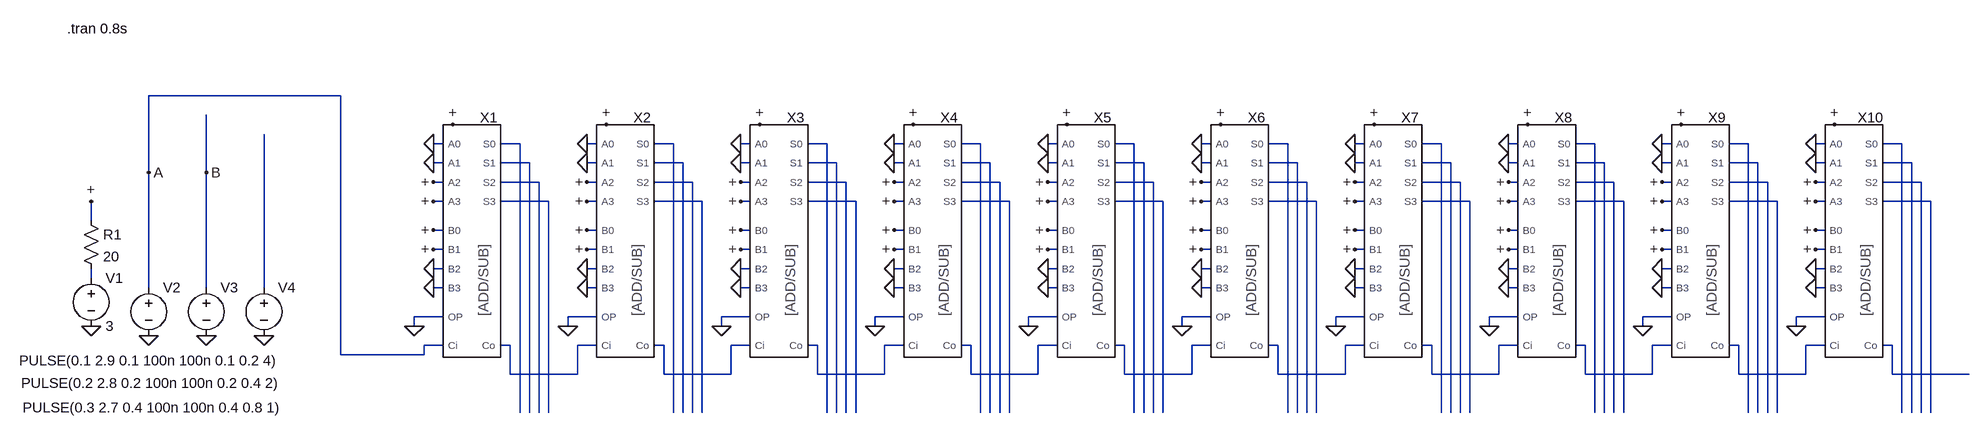
[diagram p0: schematic main.asc]
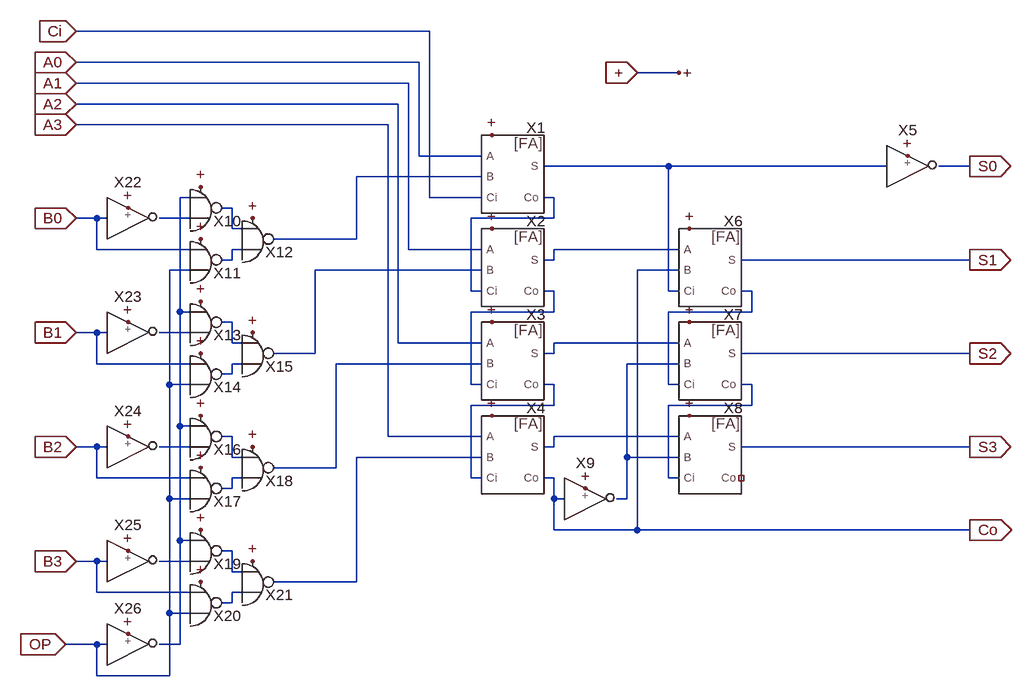
[diagram p1: sub-circuit addsub.asc]
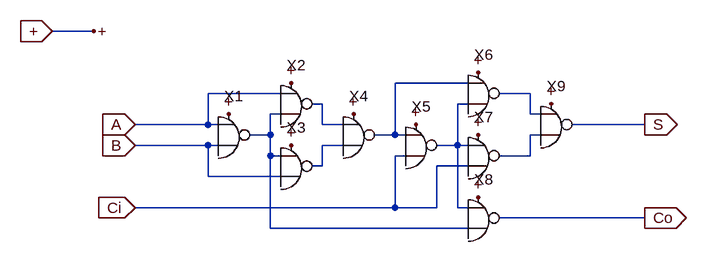
[diagram p2: sub-circuit fa.asc]
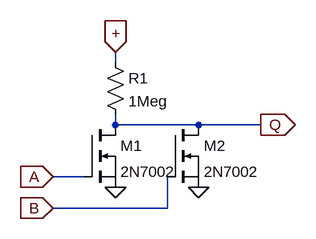
[diagram p3: sub-circuit nor2.asc]
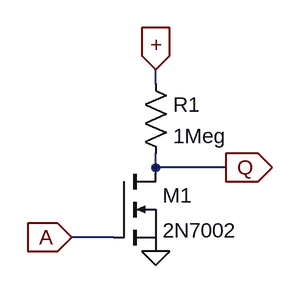
[diagram p4: sub-circuit inv.asc]
main.asc, the LTspice schematic file:
Version 4
SHEET 1 2644 1588
WIRE -208 1056 -528 1056
WIRE 96 1136 80 1136
WIRE 224 1136 192 1136
WIRE 352 1136 336 1136
WIRE 480 1136 448 1136
WIRE 608 1136 592 1136
WIRE 736 1136 704 1136
WIRE 864 1136 848 1136
WIRE 992 1136 960 1136
WIRE 1120 1136 1104 1136
WIRE 1248 1136 1216 1136
WIRE 1376 1136 1360 1136
WIRE 1504 1136 1472 1136
WIRE 1632 1136 1616 1136
WIRE 1760 1136 1728 1136
WIRE 1888 1136 1872 1136
WIRE 2016 1136 1984 1136
WIRE 2144 1136 2128 1136
WIRE 2272 1136 2240 1136
WIRE 2400 1136 2384 1136
WIRE 2528 1136 2496 1136
WIRE 96 1168 80 1168
WIRE 240 1168 192 1168
WIRE 352 1168 336 1168
WIRE 496 1168 448 1168
WIRE 608 1168 592 1168
WIRE 752 1168 704 1168
WIRE 864 1168 848 1168
WIRE 1008 1168 960 1168
WIRE 1120 1168 1104 1168
WIRE 1264 1168 1216 1168
WIRE 1376 1168 1360 1168
WIRE 1520 1168 1472 1168
WIRE 1632 1168 1616 1168
WIRE 1776 1168 1728 1168
WIRE 1888 1168 1872 1168
WIRE 2032 1168 1984 1168
WIRE 2144 1168 2128 1168
WIRE 2288 1168 2240 1168
WIRE 2400 1168 2384 1168
WIRE 2544 1168 2496 1168
WIRE -528 1184 -528 1056
WIRE -432 1184 -432 1088
WIRE 96 1200 80 1200
WIRE 256 1200 192 1200
WIRE 352 1200 336 1200
WIRE 512 1200 448 1200
WIRE 608 1200 592 1200
WIRE 768 1200 704 1200
WIRE 864 1200 848 1200
WIRE 1024 1200 960 1200
WIRE 1120 1200 1104 1200
WIRE 1280 1200 1216 1200
WIRE 1376 1200 1360 1200
WIRE 1536 1200 1472 1200
WIRE 1632 1200 1616 1200
WIRE 1792 1200 1728 1200
WIRE 1888 1200 1872 1200
WIRE 2048 1200 1984 1200
WIRE 2144 1200 2128 1200
WIRE 2304 1200 2240 1200
WIRE 2400 1200 2384 1200
WIRE 2560 1200 2496 1200
WIRE 96 1232 80 1232
WIRE 272 1232 192 1232
WIRE 352 1232 336 1232
WIRE 528 1232 448 1232
WIRE 608 1232 592 1232
WIRE 784 1232 704 1232
WIRE 864 1232 848 1232
WIRE 1040 1232 960 1232
WIRE 1120 1232 1104 1232
WIRE 1296 1232 1216 1232
WIRE 1376 1232 1360 1232
WIRE 1552 1232 1472 1232
WIRE 1632 1232 1616 1232
WIRE 1808 1232 1728 1232
WIRE 1888 1232 1872 1232
WIRE 2064 1232 1984 1232
WIRE 2144 1232 2128 1232
WIRE 2320 1232 2240 1232
WIRE 2400 1232 2384 1232
WIRE 2576 1232 2496 1232
WIRE -624 1264 -624 1232
WIRE 96 1280 80 1280
WIRE 352 1280 336 1280
WIRE 608 1280 592 1280
WIRE 864 1280 848 1280
WIRE 1120 1280 1104 1280
WIRE 1376 1280 1360 1280
WIRE 1632 1280 1616 1280
WIRE 1888 1280 1872 1280
WIRE 2144 1280 2128 1280
WIRE 2400 1280 2384 1280
WIRE 96 1312 80 1312
WIRE 352 1312 336 1312
WIRE 608 1312 592 1312
WIRE 864 1312 848 1312
WIRE 1120 1312 1104 1312
WIRE 1376 1312 1360 1312
WIRE 1632 1312 1616 1312
WIRE 1888 1312 1872 1312
WIRE 2144 1312 2128 1312
WIRE 2400 1312 2384 1312
WIRE 96 1344 80 1344
WIRE 352 1344 336 1344
WIRE 608 1344 592 1344
WIRE 864 1344 848 1344
WIRE 1120 1344 1104 1344
WIRE 1376 1344 1360 1344
WIRE 1632 1344 1616 1344
WIRE 1888 1344 1872 1344
WIRE 2144 1344 2128 1344
WIRE 2400 1344 2384 1344
WIRE -624 1360 -624 1344
WIRE -528 1376 -528 1184
WIRE -432 1376 -432 1184
WIRE -336 1376 -336 1120
WIRE 96 1376 80 1376
WIRE 352 1376 336 1376
WIRE 608 1376 592 1376
WIRE 864 1376 848 1376
WIRE 1120 1376 1104 1376
WIRE 1376 1376 1360 1376
WIRE 1632 1376 1616 1376
WIRE 1888 1376 1872 1376
WIRE 2144 1376 2128 1376
WIRE 2400 1376 2384 1376
WIRE 96 1424 48 1424
WIRE 352 1424 304 1424
WIRE 608 1424 560 1424
WIRE 864 1424 816 1424
WIRE 1120 1424 1072 1424
WIRE 1376 1424 1328 1424
WIRE 1632 1424 1584 1424
WIRE 1888 1424 1840 1424
WIRE 2144 1424 2096 1424
WIRE 2400 1424 2352 1424
WIRE 48 1440 48 1424
WIRE 304 1440 304 1424
WIRE 560 1440 560 1424
WIRE 816 1440 816 1424
WIRE 1072 1440 1072 1424
WIRE 1328 1440 1328 1424
WIRE 1584 1440 1584 1424
WIRE 1840 1440 1840 1424
WIRE 2096 1440 2096 1424
WIRE 2352 1440 2352 1424
WIRE 96 1472 64 1472
WIRE 208 1472 192 1472
WIRE 352 1472 320 1472
WIRE 464 1472 448 1472
WIRE 608 1472 576 1472
WIRE 720 1472 704 1472
WIRE 864 1472 832 1472
WIRE 976 1472 960 1472
WIRE 1120 1472 1088 1472
WIRE 1232 1472 1216 1472
WIRE 1376 1472 1344 1472
WIRE 1488 1472 1472 1472
WIRE 1632 1472 1600 1472
WIRE 1744 1472 1728 1472
WIRE 1888 1472 1856 1472
WIRE 2000 1472 1984 1472
WIRE 2144 1472 2112 1472
WIRE 2256 1472 2240 1472
WIRE 2400 1472 2368 1472
WIRE 2512 1472 2496 1472
WIRE -208 1488 -208 1056
WIRE 64 1488 64 1472
WIRE 64 1488 -208 1488
WIRE 208 1520 208 1472
WIRE 320 1520 320 1472
WIRE 320 1520 208 1520
WIRE 464 1520 464 1472
WIRE 576 1520 576 1472
WIRE 576 1520 464 1520
WIRE 720 1520 720 1472
WIRE 832 1520 832 1472
WIRE 832 1520 720 1520
WIRE 976 1520 976 1472
WIRE 1088 1520 1088 1472
WIRE 1088 1520 976 1520
WIRE 1232 1520 1232 1472
WIRE 1344 1520 1344 1472
WIRE 1344 1520 1232 1520
WIRE 1488 1520 1488 1472
WIRE 1600 1520 1600 1472
WIRE 1600 1520 1488 1520
WIRE 1744 1520 1744 1472
WIRE 1856 1520 1856 1472
WIRE 1856 1520 1744 1520
WIRE 2000 1520 2000 1472
WIRE 2112 1520 2112 1472
WIRE 2112 1520 2000 1520
WIRE 2256 1520 2256 1472
WIRE 2368 1520 2368 1472
WIRE 2368 1520 2256 1520
WIRE 2512 1520 2512 1472
WIRE 2640 1520 2512 1520
WIRE 224 1584 224 1136
WIRE 240 1584 240 1168
WIRE 256 1584 256 1200
WIRE 272 1584 272 1232
WIRE 480 1584 480 1136
WIRE 496 1584 496 1168
WIRE 512 1584 512 1200
WIRE 528 1584 528 1232
WIRE 736 1584 736 1136
WIRE 752 1584 752 1168
WIRE 768 1584 768 1200
WIRE 784 1584 784 1232
WIRE 992 1584 992 1136
WIRE 1008 1584 1008 1168
WIRE 1024 1584 1024 1200
WIRE 1040 1584 1040 1232
WIRE 1248 1584 1248 1136
WIRE 1264 1584 1264 1168
WIRE 1280 1584 1280 1200
WIRE 1296 1584 1296 1232
WIRE 1504 1584 1504 1136
WIRE 1520 1584 1520 1168
WIRE 1536 1584 1536 1200
WIRE 1552 1584 1552 1232
WIRE 1760 1584 1760 1136
WIRE 1776 1584 1776 1168
WIRE 1792 1584 1792 1200
WIRE 1808 1584 1808 1232
WIRE 2016 1584 2016 1136
WIRE 2032 1584 2032 1168
WIRE 2048 1584 2048 1200
WIRE 2064 1584 2064 1232
WIRE 2272 1584 2272 1136
WIRE 2288 1584 2288 1168
WIRE 2304 1584 2304 1200
WIRE 2320 1584 2320 1232
WIRE 2528 1584 2528 1136
WIRE 2544 1584 2544 1168
WIRE 2560 1584 2560 1200
WIRE 2576 1584 2576 1232
FLAG -624 1440 0
FLAG -624 1232 +
FLAG -528 1456 0
FLAG -432 1456 0
FLAG -336 1456 0
FLAG -528 1184 A
FLAG -432 1184 B
FLAG 112 1104 +
FLAG 80 1232 +
FLAG 80 1200 +
FLAG 80 1168 0
FLAG 80 1136 0
FLAG 80 1344 0
FLAG 80 1376 0
FLAG 80 1312 +
FLAG 80 1280 +
FLAG 48 1440 0
FLAG 368 1104 +
FLAG 336 1232 +
FLAG 336 1200 +
FLAG 336 1168 0
FLAG 336 1136 0
FLAG 336 1344 0
FLAG 336 1376 0
FLAG 336 1312 +
FLAG 336 1280 +
FLAG 304 1440 0
FLAG 624 1104 +
FLAG 592 1232 +
FLAG 592 1200 +
FLAG 592 1168 0
FLAG 592 1136 0
FLAG 592 1344 0
FLAG 592 1376 0
FLAG 592 1312 +
FLAG 592 1280 +
FLAG 560 1440 0
FLAG 880 1104 +
FLAG 848 1232 +
FLAG 848 1200 +
FLAG 848 1168 0
FLAG 848 1136 0
FLAG 848 1344 0
FLAG 848 1376 0
FLAG 848 1312 +
FLAG 848 1280 +
FLAG 816 1440 0
FLAG 1136 1104 +
FLAG 1104 1232 +
FLAG 1104 1200 +
FLAG 1104 1168 0
FLAG 1104 1136 0
FLAG 1104 1344 0
FLAG 1104 1376 0
FLAG 1104 1312 +
FLAG 1104 1280 +
FLAG 1072 1440 0
FLAG 1392 1104 +
FLAG 1360 1232 +
FLAG 1360 1200 +
FLAG 1360 1168 0
FLAG 1360 1136 0
FLAG 1360 1344 0
FLAG 1360 1376 0
FLAG 1360 1312 +
FLAG 1360 1280 +
FLAG 1328 1440 0
FLAG 1648 1104 +
FLAG 1616 1232 +
FLAG 1616 1200 +
FLAG 1616 1168 0
FLAG 1616 1136 0
FLAG 1616 1344 0
FLAG 1616 1376 0
FLAG 1616 1312 +
FLAG 1616 1280 +
FLAG 1584 1440 0
FLAG 1904 1104 +
FLAG 1872 1232 +
FLAG 1872 1200 +
FLAG 1872 1168 0
FLAG 1872 1136 0
FLAG 1872 1344 0
FLAG 1872 1376 0
FLAG 1872 1312 +
FLAG 1872 1280 +
FLAG 1840 1440 0
FLAG 2160 1104 +
FLAG 2128 1232 +
FLAG 2128 1200 +
FLAG 2128 1168 0
FLAG 2128 1136 0
FLAG 2128 1344 0
FLAG 2128 1376 0
FLAG 2128 1312 +
FLAG 2128 1280 +
FLAG 2096 1440 0
FLAG 2416 1104 +
FLAG 2384 1232 +
FLAG 2384 1200 +
FLAG 2384 1168 0
FLAG 2384 1136 0
FLAG 2384 1344 0
FLAG 2384 1376 0
FLAG 2384 1312 +
FLAG 2384 1280 +
FLAG 2352 1440 0
SYMBOL voltage -624 1344 R0
SYMATTR InstName V1
SYMATTR Value 3
SYMATTR SpiceLine Rser=0
SYMBOL res -640 1248 R0
SYMATTR InstName R1
SYMATTR Value 20
SYMBOL voltage -528 1360 R0
WINDOW 3 -216 138 Left 2
SYMATTR InstName V2
SYMATTR Value PULSE(0.1 2.9 0.1 100n 100n 0.1 0.2 4)
SYMBOL voltage -432 1360 R0
WINDOW 3 -309 175 Left 2
SYMATTR InstName V3
SYMATTR Value PULSE(0.2 2.8 0.2 100n 100n 0.2 0.4 2)
SYMBOL voltage -336 1360 R0
WINDOW 3 -402 216 Left 2
SYMATTR InstName V4
SYMATTR Value PULSE(0.3 2.7 0.4 100n 100n 0.4 0.8 1)
SYMBOL AddSub 144 1280 R0
SYMATTR InstName X1
SYMBOL AddSub 400 1280 R0
SYMATTR InstName X2
SYMBOL AddSub 656 1280 R0
SYMATTR InstName X3
SYMBOL AddSub 912 1280 R0
SYMATTR InstName X4
SYMBOL AddSub 1168 1280 R0
SYMATTR InstName X5
SYMBOL AddSub 1424 1280 R0
SYMATTR InstName X6
SYMBOL AddSub 1680 1280 R0
SYMATTR InstName X7
SYMBOL AddSub 1936 1280 R0
SYMATTR InstName X8
SYMBOL AddSub 2192 1280 R0
SYMATTR InstName X9
SYMBOL AddSub 2448 1280 R0
SYMATTR InstName X10
TEXT -664 944 Left 2 !.tran 0.8s

addsub.asc, the sub-circuit schematic file:
Version 4
SHEET 1 1180 680
WIRE 272 -352 -272 -352
WIRE 256 -304 -272 -304
WIRE 656 -288 592 -288
WIRE 240 -272 -272 -272
WIRE 224 -240 -272 -240
WIRE 208 -208 -272 -208
WIRE 256 -160 256 -304
WIRE 352 -160 256 -160
WIRE 640 -144 448 -144
WIRE 976 -144 640 -144
WIRE 1104 -144 1056 -144
WIRE 352 -128 160 -128
WIRE -96 -96 -112 -96
WIRE 272 -96 272 -352
WIRE 352 -96 272 -96
WIRE 464 -96 448 -96
WIRE -32 -80 -48 -80
WIRE -240 -64 -272 -64
WIRE -224 -64 -240 -64
WIRE -96 -64 -144 -64
WIRE 464 -64 464 -96
WIRE 464 -64 336 -64
WIRE -32 -48 -32 -80
WIRE -16 -48 -32 -48
WIRE 160 -32 160 -128
WIRE 160 -32 32 -32
WIRE -240 -16 -240 -64
WIRE -96 -16 -240 -16
WIRE -16 -16 -32 -16
WIRE 240 -16 240 -272
WIRE 352 -16 240 -16
WIRE 656 -16 464 -16
WIRE -32 0 -32 -16
WIRE -32 0 -48 0
WIRE 464 0 464 -16
WIRE 464 0 448 0
WIRE 1104 0 752 0
WIRE -96 16 -128 16
WIRE 352 16 96 16
WIRE 656 16 592 16
WIRE 336 48 336 -64
WIRE 352 48 336 48
WIRE 464 48 448 48
WIRE 640 48 640 -144
WIRE 656 48 640 48
WIRE 768 48 752 48
WIRE -112 80 -112 -96
WIRE -96 80 -112 80
WIRE 464 80 464 48
WIRE 464 80 336 80
WIRE 768 80 768 48
WIRE 768 80 640 80
WIRE -32 96 -48 96
WIRE -240 112 -272 112
WIRE -224 112 -240 112
WIRE -96 112 -144 112
WIRE -32 128 -32 96
WIRE -16 128 -32 128
WIRE 224 128 224 -240
WIRE 352 128 224 128
WIRE 656 128 464 128
WIRE 96 144 96 16
WIRE 96 144 32 144
WIRE 464 144 464 128
WIRE 464 144 448 144
WIRE 1104 144 752 144
WIRE -240 160 -240 112
WIRE -96 160 -240 160
WIRE -16 160 -32 160
WIRE 352 160 128 160
WIRE 656 160 576 160
WIRE -32 176 -32 160
WIRE -32 176 -48 176
WIRE -128 192 -128 16
WIRE -96 192 -128 192
WIRE 336 192 336 80
WIRE 352 192 336 192
WIRE 464 192 448 192
WIRE 640 192 640 80
WIRE 656 192 640 192
WIRE 768 192 752 192
WIRE 464 224 464 192
WIRE 464 224 336 224
WIRE 768 224 768 192
WIRE 768 224 640 224
WIRE -112 256 -112 80
WIRE -96 256 -112 256
WIRE -32 272 -48 272
WIRE 208 272 208 -208
WIRE 352 272 208 272
WIRE 656 272 464 272
WIRE -240 288 -272 288
WIRE -224 288 -240 288
WIRE -96 288 -144 288
WIRE 464 288 464 272
WIRE 464 288 448 288
WIRE 1104 288 752 288
WIRE -32 304 -32 272
WIRE -16 304 -32 304
WIRE 352 304 160 304
WIRE 576 304 576 160
WIRE 656 304 576 304
WIRE 128 320 128 160
WIRE 128 320 32 320
WIRE -240 336 -240 288
WIRE -96 336 -240 336
WIRE -16 336 -32 336
WIRE 336 336 336 224
WIRE 352 336 336 336
WIRE 464 336 448 336
WIRE 640 336 640 224
WIRE 656 336 640 336
WIRE -32 352 -32 336
WIRE -32 352 -48 352
WIRE -128 368 -128 192
WIRE -96 368 -128 368
WIRE 464 368 464 336
WIRE 480 368 464 368
WIRE 576 368 576 304
WIRE 576 368 560 368
WIRE 464 416 464 368
WIRE 592 416 592 16
WIRE 592 416 464 416
WIRE 1104 416 592 416
WIRE -112 432 -112 256
WIRE -96 432 -112 432
WIRE -32 448 -48 448
WIRE -240 464 -272 464
WIRE -224 464 -240 464
WIRE -96 464 -144 464
WIRE -32 480 -32 448
WIRE -16 480 -32 480
WIRE 160 496 160 304
WIRE 160 496 32 496
WIRE -240 512 -240 464
WIRE -96 512 -240 512
WIRE -16 512 -32 512
WIRE -32 528 -32 512
WIRE -32 528 -48 528
WIRE -128 544 -128 368
WIRE -96 544 -128 544
WIRE -240 592 -288 592
WIRE -224 592 -240 592
WIRE -112 592 -112 432
WIRE -112 592 -144 592
WIRE -240 640 -240 592
WIRE -128 640 -128 544
WIRE -128 640 -240 640
FLAG 368 -192 +
FLAG 368 -48 +
FLAG 368 96 +
FLAG 368 240 +
FLAG 672 -48 +
FLAG 672 96 +
FLAG 672 240 +
FLAG 512 352 +
FLAG 1008 -160 +
FLAG -80 -112 +
FLAG -80 -32 +
FLAG 0 -64 +
FLAG -80 64 +
FLAG -80 144 +
FLAG 0 112 +
FLAG -80 240 +
FLAG -80 320 +
FLAG 0 288 +
FLAG -80 416 +
FLAG -80 496 +
FLAG 0 464 +
FLAG -192 -80 +
FLAG -192 96 +
FLAG -192 272 +
FLAG -192 448 +
FLAG -192 576 +
FLAG -288 592 OP
IOPIN -288 592 In
FLAG -272 -352 Ci
IOPIN -272 -352 In
FLAG -272 -304 A0
IOPIN -272 -304 In
FLAG -272 -272 A1
IOPIN -272 -272 In
FLAG -272 -240 A2
IOPIN -272 -240 In
FLAG -272 -208 A3
IOPIN -272 -208 In
FLAG -272 -64 B0
IOPIN -272 -64 In
FLAG -272 112 B1
IOPIN -272 112 In
FLAG -272 288 B2
IOPIN -272 288 In
FLAG -272 464 B3
IOPIN -272 464 In
FLAG 1104 -144 S0
IOPIN 1104 -144 Out
FLAG 1104 0 S1
IOPIN 1104 0 Out
FLAG 1104 144 S2
IOPIN 1104 144 Out
FLAG 1104 288 S3
IOPIN 1104 288 Out
FLAG 1104 416 Co
IOPIN 1104 416 Out
FLAG 592 -288 +
IOPIN 592 -288 In
FLAG 656 -288 +
FLAG 656 -288 +
SYMBOL FA 400 -144 R0
SYMATTR InstName X1
SYMBOL FA 400 0 R0
SYMATTR InstName X2
SYMBOL FA 400 144 R0
SYMATTR InstName X3
SYMBOL FA 400 288 R0
SYMATTR InstName X4
SYMBOL INV 1008 -144 R0
SYMATTR InstName X5
SYMBOL FA 704 0 R0
SYMATTR InstName X6
SYMBOL FA 704 144 R0
SYMATTR InstName X7
SYMBOL FA 704 288 R0
SYMATTR InstName X8
SYMBOL INV 512 368 R0
SYMATTR InstName X9
SYMBOL NOR2 -64 -80 R0
SYMATTR InstName X10
SYMBOL NOR2 -64 0 R0
SYMATTR InstName X11
SYMBOL NOR2 16 -32 R0
SYMATTR InstName X12
SYMBOL NOR2 -64 96 R0
SYMATTR InstName X13
SYMBOL NOR2 -64 176 R0
SYMATTR InstName X14
SYMBOL NOR2 16 144 R0
SYMATTR InstName X15
SYMBOL NOR2 -64 272 R0
SYMATTR InstName X16
SYMBOL NOR2 -64 352 R0
SYMATTR InstName X17
SYMBOL NOR2 16 320 R0
SYMATTR InstName X18
SYMBOL NOR2 -64 448 R0
SYMATTR InstName X19
SYMBOL NOR2 -64 528 R0
SYMATTR InstName X20
SYMBOL NOR2 16 496 R0
SYMATTR InstName X21
SYMBOL INV -192 -64 R0
SYMATTR InstName X22
SYMBOL INV -192 112 R0
SYMATTR InstName X23
SYMBOL INV -192 288 R0
SYMATTR InstName X24
SYMBOL INV -192 464 R0
SYMATTR InstName X25
SYMBOL INV -192 592 R0
SYMATTR InstName X26

fa.asc, the sub-circuit schematic file:
Version 4
SHEET 1 880 680
WIRE -128 -16 -192 -16
WIRE 448 64 336 64
WIRE 160 80 48 80
WIRE 544 80 496 80
WIRE 224 96 208 96
WIRE 448 96 432 96
WIRE 160 112 144 112
WIRE 544 112 544 80
WIRE 560 112 544 112
WIRE 48 128 48 80
WIRE 48 128 -64 128
WIRE 64 128 48 128
WIRE 224 128 224 96
WIRE 256 128 224 128
WIRE 720 128 608 128
WIRE 144 144 144 112
WIRE 144 144 112 144
WIRE 336 144 336 64
WIRE 336 144 304 144
WIRE 352 144 336 144
WIRE 560 144 544 144
WIRE 48 160 -64 160
WIRE 64 160 48 160
WIRE 256 160 224 160
WIRE 432 160 432 96
WIRE 432 160 400 160
WIRE 448 160 432 160
WIRE 144 176 144 144
WIRE 160 176 144 176
WIRE 352 176 336 176
WIRE 544 176 544 144
WIRE 544 176 496 176
WIRE 224 192 224 160
WIRE 224 192 208 192
WIRE 448 192 400 192
WIRE 48 208 48 160
WIRE 160 208 48 208
WIRE 336 256 336 176
WIRE 336 256 -64 256
WIRE 400 256 400 192
WIRE 400 256 336 256
WIRE 432 256 432 160
WIRE 448 256 432 256
WIRE 720 272 496 272
WIRE 144 288 144 176
WIRE 448 288 144 288
FLAG 80 112 +
FLAG 176 160 +
FLAG 176 64 +
FLAG 272 112 +
FLAG 464 48 +
FLAG 464 144 +
FLAG 464 240 +
FLAG 576 96 +
FLAG 368 128 +
FLAG -192 -16 +
IOPIN -192 -16 In
FLAG -128 -16 +
FLAG -64 128 A
IOPIN -64 128 In
FLAG -64 160 B
IOPIN -64 160 In
FLAG -64 256 Ci
IOPIN -64 256 In
FLAG 720 272 Co
IOPIN 720 272 Out
FLAG 720 128 S
IOPIN 720 128 Out
SYMBOL NOR2 96 144 R0
WINDOW 0 -8 -44 Bottom 2
SYMATTR InstName X1
SYMBOL NOR2 192 192 R0
WINDOW 0 -8 -44 Bottom 2
SYMATTR InstName X3
SYMBOL NOR2 288 144 R0
WINDOW 0 -8 -44 Bottom 2
SYMATTR InstName X4
SYMBOL NOR2 480 80 R0
WINDOW 0 -8 -44 Bottom 2
SYMATTR InstName X6
SYMBOL NOR2 480 176 R0
WINDOW 0 -8 -44 Bottom 2
SYMATTR InstName X7
SYMBOL NOR2 480 272 R0
WINDOW 0 -8 -44 Bottom 2
SYMATTR InstName X8
SYMBOL NOR2 592 128 R0
WINDOW 0 -8 -44 Bottom 2
SYMATTR InstName X9
SYMBOL NOR2 192 96 R0
WINDOW 0 -8 -44 Bottom 2
SYMATTR InstName X2
SYMBOL NOR2 384 160 R0
WINDOW 0 -8 -44 Bottom 2
SYMATTR InstName X5

nor2.asc, the sub-circuit schematic file:
Version 4
SHEET 1 880 680
WIRE 272 144 272 128
WIRE 272 240 272 224
WIRE 400 240 272 240
WIRE 496 240 400 240
WIRE 224 320 176 320
WIRE 352 368 352 320
WIRE 352 368 176 368
FLAG 272 336 0
FLAG 176 320 A
IOPIN 176 320 In
FLAG 496 240 Q
IOPIN 496 240 Out
FLAG 272 128 +
IOPIN 272 128 In
FLAG 400 336 0
FLAG 176 368 B
IOPIN 176 368 In
SYMBOL nmos 224 240 R0
SYMATTR InstName M1
SYMATTR Value 2N7002
SYMBOL res 256 128 R0
SYMATTR InstName R1
SYMATTR Value 1Meg
SYMBOL nmos 352 240 R0
SYMATTR InstName M2
SYMATTR Value 2N7002

inv.asc, the sub-circuit schematic file:
Version 4
SHEET 1 880 680
WIRE 272 144 272 128
WIRE 272 240 272 224
WIRE 352 240 272 240
WIRE 224 320 176 320
FLAG 272 336 0
FLAG 176 320 A
IOPIN 176 320 In
FLAG 352 240 Q
IOPIN 352 240 Out
FLAG 272 128 +
IOPIN 272 128 In
SYMBOL nmos 224 240 R0
SYMATTR InstName M1
SYMATTR Value 2N7002
SYMBOL res 256 128 R0
SYMATTR InstName R1
SYMATTR Value 1Meg

The netlist it stands for:
* main.asc
V1 N041 0 3 Rser=0
R1 + N041 20
V2 A 0 PULSE(0.1 2.9 0.1 100n 100n 0.1 0.2 4)
V3 B 0 PULSE(0.2 2.8 0.2 100n 100n 0.2 0.4 2)
V4 N042 0 PULSE(0.3 2.7 0.4 100n 100n 0.4 0.8 1)
XX1 + 0 0 + + + + 0 0 A 0 N043 N001 N011 N021 N031 addsub
XX2 + 0 0 + + + + 0 0 N043 0 N044 N002 N012 N022 N032 addsub
XX3 + 0 0 + + + + 0 0 N044 0 N045 N003 N013 N023 N033 addsub
XX4 + 0 0 + + + + 0 0 N045 0 N046 N004 N014 N024 N034 addsub
XX5 + 0 0 + + + + 0 0 N046 0 N047 N005 N015 N025 N035 addsub
XX6 + 0 0 + + + + 0 0 N047 0 N048 N006 N016 N026 N036 addsub
XX7 + 0 0 + + + + 0 0 N048 0 N049 N007 N017 N027 N037 addsub
XX8 + 0 0 + + + + 0 0 N049 0 N050 N008 N018 N028 N038 addsub
XX9 + 0 0 + + + + 0 0 N050 0 N051 N009 N019 N029 N039 addsub
XX10 + 0 0 + + + + 0 0 N051 0 N052 N010 N020 N030 N040 addsub

* block symbol definitions
.subckt addsub + A0 A1 A2 A3 B0 B1 B2 B3 Ci OP Co S0 S1 S2 S3
XX1 + A0 N002 Ci N004 N001 fa
XX2 + A1 N009 N004 N010 N008 fa
XX3 + A2 N016 N010 N018 N014 fa
XX4 + A3 N023 N018 Co N021 fa
XX5 + N001 S0 inv
XX6 + N008 Co N001 N011 S1 fa
XX7 + N014 N017 N011 N019 S2 fa
XX8 + N021 N017 N019 NC_01 S3 fa
XX9 + Co N017 inv
XX10 + N003 N006 N005 nor2
XX11 + B0 OP N007 nor2
XX12 + N005 N007 N002 nor2
XX13 + N003 N013 N012 nor2
XX14 + B1 OP N015 nor2
XX15 + N012 N015 N009 nor2
XX16 + N003 N022 N020 nor2
XX17 + B2 OP N024 nor2
XX18 + N020 N024 N016 nor2
XX19 + N003 N026 N025 nor2
XX20 + B3 OP N027 nor2
XX21 + N025 N027 N023 nor2
XX22 + B0 N006 inv
XX23 + B1 N013 inv
XX24 + B2 N022 inv
XX25 + B3 N026 inv
XX26 + OP N003 inv
.ends addsub

.subckt fa + A B Ci Co S
XX1 + A B N005 nor2
XX3 + N005 B N007 nor2
XX4 + N003 N007 N001 nor2
XX6 + N001 N004 N002 nor2
XX7 + N004 Ci N006 nor2
XX8 + N004 N005 Co nor2
XX9 + N002 N006 S nor2
XX2 + A N005 N003 nor2
XX5 + N001 Ci N004 nor2
.ends fa

.subckt nor2 + A B Q
M1 Q A 0 0 2N7002
R1 + Q 1Meg
M2 Q B 0 0 2N7002
.ends nor2

.subckt inv + A Q
M1 Q A 0 0 2N7002
R1 + Q 1Meg
.ends inv

.model NMOS NMOS
.model PMOS PMOS
.lib standard.mos
.tran 0.8s
.backanno
.end